# EAGLE board Ideamart-NB-IoT-Air-Quality-Sensor-v1 (EAGLE 8.6.0)
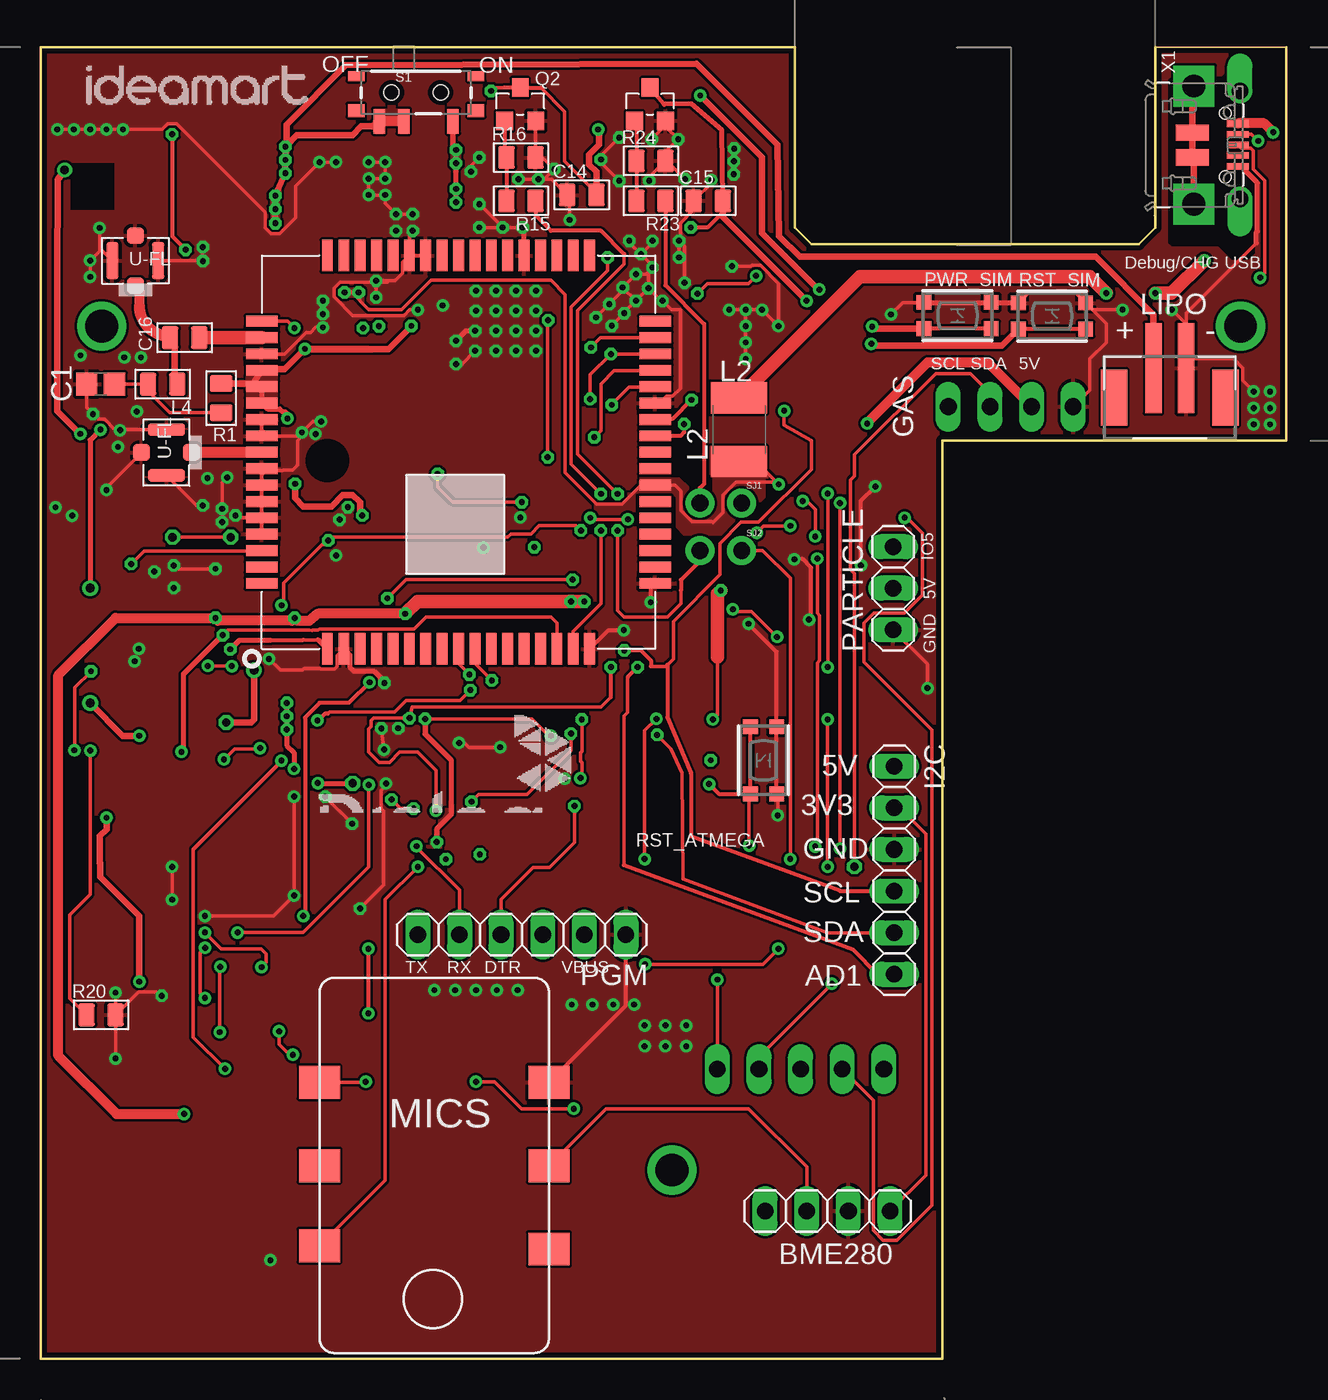
[diagram p3: board, top side]
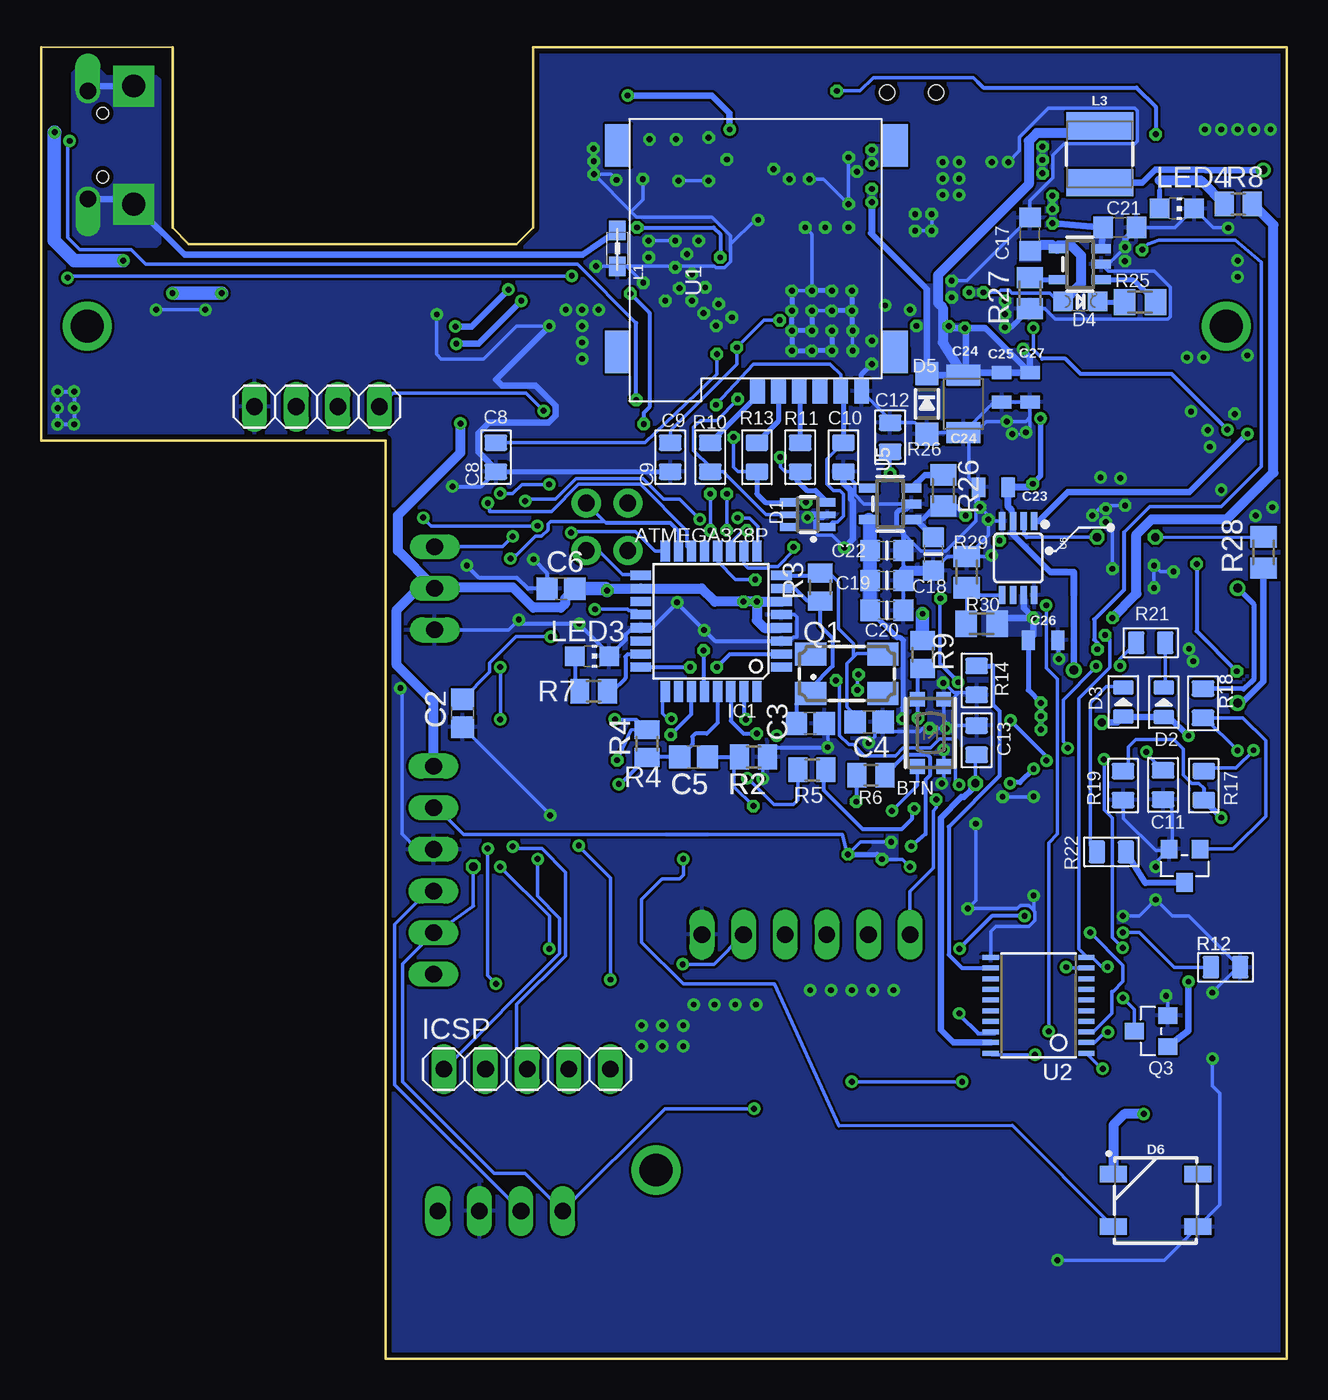
[diagram p4: board, bottom side, seen from below]

Size 76 x 80 mm. Coordinates in mm from the lower left corner, seen from the top.
Outline: 0,0 0,80 46,80 46,69 47,68 67,68 68,69 68,80 76,80 76,56 55,56 55,0 0,0
Copper layers (1*16): Top 0.035mm / dielectric 1.5mm / Bottom 0.035mm
Design rules "default *": minimum track width 8mil, minimum drill 14mil, track to track 6mil, track to pad 6mil, pad to pad 6mil, via to via 6mil, smd to smd 6mil, copper to edge 12mil, drill to drill 8mil, minimum pad ring 10mil, minimum via ring 8mil, stop-mask expansion 4mil, vias tented up to drill 14mil, thermal gap 8mil
Net classes: 1 power: width 0.406 mm, drill 0.356 mm, clearance 0.152 mm; 2 gnd: width 0.203 mm, drill 0.356 mm, clearance 0.152 mm; 3 usbvcc: width 0.203 mm, drill 0.356 mm, clearance 0.152 mm; 4 aref: width 0.203 mm, drill 0.356 mm, clearance 0.152 mm; 5 ant: width 0.33 mm, clearance 0.66 mm

## Footprints (pad centres in the part's own frame; a part is rotated, then mirrored left to right if it is on the bottom)
1X04 = drill 1.016 long: 1 -3.81,0; 2 -1.27,0; 3 1.27,0; 4 3.81,0
BTN_KMR2_4.6X2.8 = smd 0.9 x 0.9: A 2.05,0.8; A' -2.05,0.8; B 2.05,-0.8; B' -2.05,-0.8
C0805 = smd 1.3 x 1.4: 1 -0.85,0; 2 0.85,0
0805 = smd 1.016 x 1.397: 1 -0.889,0; 2 0.889,0
_0805 = smd 1.2 x 1.3: 1 -1.016,0; 2 1.016,0
_0805MP = smd 1.2 x 1.3: 1 -1.016,0; 2 1.016,0
0805' = smd 0.8 x 1.2: 1 -0.9,0; 2 0.9,0
1210 = smd 1.27 x 2.06: 1 -1.755,0; 2 1.755,0
SOT363 = smd 0.5 x 1: 1 -0.75,-1.2; 3 0.75,-1.2; 4 0.75,1.2; 6 -0.75,1.2 | smd 0.4 x 1: 2 0,-1.2; 5 0,1.2
LED-0805 = smd 0.889 x 1.27: + -0.889,0; - 0.889,0
CHIPLED_0805 = smd 1.2 x 1.2: A 0,-1.05; C 0,1.05
SOD-123 = smd 1.4 x 1.4: A 1.85,0; C -1.85,0
WS2812B = smd 1.651 x 1: 1 2.577,-1.6; 2 2.577,1.6; 3 -2.577,1.6; 4 -2.577,-1.6
4P-U-FL = smd 1.016 x 1.016: D -1.524,0; GND3 1.524,0 | smd 2.286 x 0.762: GND1 0,1.397; GND2 0,-1.397
1X06 = drill 1.016 long: 1 -6.35,0; 2 -3.81,0; 3 -1.27,0; 4 1.27,0; 5 3.81,0; 6 6.35,0
TQFP32-08 = smd 1.27 x 0.559: 1 -4.293,2.8; 2 -4.293,2; 3 -4.293,1.2; 4 -4.293,0.4; 5 -4.293,-0.4; 6 -4.293,-1.2; 7 -4.293,-2; 8 -4.293,-2.8; 17 4.293,-2.8; 18 4.293,-2; 19 4.293,-1.2; 20 4.293,-0.4; 21 4.293,0.4; 22 4.293,1.2; 23 4.293,2; 24 4.293,2.8 | smd 0.559 x 1.27: 9 -2.8,-4.293; 10 -2,-4.293; 11 -1.2,-4.293; 12 -0.4,-4.293; 13 0.4,-4.293; 14 1.2,-4.293; 15 2,-4.293; 16 2.8,-4.293; 25 2.8,4.293; 26 2,4.293; 27 1.2,4.293; 28 0.4,4.293; 29 -0.4,4.293; 30 -1.2,4.293; 31 -2,4.293; 32 -2.8,4.293
1X05 = drill 1.016 long: 1 -5.08,0; 2 -2.54,0; 3 0,0; 4 2.54,0; 5 5.08,0
0805'' = smd 1.2 x 1: 1 -1.1,0; 2 1.1,0
L1812 = smd 1.9 x 3.4: 1 -1.95,0; 2 1.95,0
INDUCTOR_4X4MM = smd 4.089 x 1.651: P$1 0,1.727; P$2 0,-1.727
L0805 = smd 1.016 x 1.397: 1 -0.889,0; 2 0.889,0
CHIP-LED0805 = smd 1.2 x 1.2: A 0,-1.05; C 0,1.05
JST-PH-2-SMT = smd 1 x 5.5: 1 -1,-1.8; 2 1,-1.8 | smd 1.6 x 3.4: NC1 -3.4,0; NC2 3.4,0
1X03 = drill 1.016 long: 1 -2.54,0; 2 0,0; 3 2.54,0
CTS406 = smd 1.9 x 1.4: 1 -2.2,-1.2; 2 2.2,-1.2; 3 2.2,1.2; 4 -2.2,1.2
SOT23 = smd 1.016 x 1.143: 1 -0.95,-1.016; 2 0.95,-1.016; 3 0,1.016
R0805 = smd 1.15 x 1.5: 1 -0.85,0; 2 0.85,0
M0805 = smd 1.3 x 1.6: 1 -0.95,0; 2 0.95,0
SWITCH-SPST-SMD-A = smd 0.7 x 1.5: 1 -2.25,-1.75; 2 -0.75,-1.75; 3 2.25,-1.75 | smd 1 x 0.6: GND1 -3.65,1; GND3 3.65,1 | smd 1 x 0.8: GND2 -3.65,-1.1; GND4 3.65,-1.1 | hole 0.9: -1.5,0; 1.5,0
SPARKFUN-PASSIVES_PTH-JUMPER-NC_BOTTOM_NO_SILK = drill 1.016 pad 1.778: 1 -1.27,0; 2 1.27,0
MICROSIM = smd 1.5 x 0.9: 1 -0.8,2.5; 2 -0.8,5.04; 3 -0.8,7.58; 5 -0.8,1.23; 6 -0.8,3.77; 7 -0.8,6.31 | smd 2.61 x 1.56: P$1 1.6,-0.8; P$2 14.2,-0.8; P$3 14.2,16.1; P$4 1.6,16.1
TSSOP20 = smd 0.305 x 0.991: 1 -2.925,-2.918; 2 -2.275,-2.918; 3 -1.625,-2.918; 4 -0.975,-2.918; 5 -0.325,-2.918; 6 0.325,-2.918; 7 0.975,-2.918; 8 1.625,-2.918; 9 2.275,-2.918; 10 2.925,-2.918; 11 2.925,2.918; 12 2.275,2.918; 13 1.625,2.918; 14 0.975,2.918; 15 0.325,2.918; 16 -0.325,2.918; 17 -0.975,2.918; 18 -1.625,2.918; 19 -2.275,2.918; 20 -2.925,2.918
SIM7000 = smd 1.93 x 0.66: 1 -12,8; 2 -12,7; 3 -12,6; 4 -12,5; 5 -12,4; 6 -12,3; 7 -12,2; 8 -12,1; 9 -12,0; 10 -12,-1; 11 -12,-2; 12 -12,-3; 13 -12,-4; 14 -12,-5; 15 -12,-6; 16 -12,-7; 17 -12,-8; 35 12,-8; 36 12,-7; 37 12,-6; 38 12,-5; 39 12,-4; 40 12,-3; 41 12,-2; 42 12,-1; 43 12,0; 44 12,1; 45 12,2; 46 12,3; 47 12,4; 48 12,5; 49 12,6; 50 12,7; 51 12,8 | smd 0.66 x 1.93: 18 -8,-12; 19 -7,-12; 20 -6,-12; 21 -5,-12; 22 -4,-12; 23 -3,-12; 24 -2,-12; 25 -1,-12; 26 0,-12; 27 1,-12; 28 2,-12; 29 3,-12; 30 4,-12; 31 5,-12; 32 6,-12; 33 7,-12; 34 8,-12; 52 8,12; 53 7,12; 54 6,12; 55 5,12; 56 4,12; 57 3,12; 58 2,12; 59 1,12; 60 0,12; 61 -1,12; 62 -2,12; 63 -3,12; 64 -4,12; 65 -5,12; 66 -6,12; 67 -7,12; 68 -8,12
SOT23-5 = smd 0.55 x 1.2: 1 -0.95,-1.3; 2 0,-1.3; 3 0.95,-1.3; 4 0.95,1.3; 5 -0.95,1.3
MSOP8 = smd 0.4 x 1.1: 1 -0.975,-2.25; 2 -0.325,-2.25; 3 0.325,-2.25; 4 0.975,-2.25; 5 0.975,2.25; 6 0.325,2.25; 7 -0.325,2.25; 8 -0.975,2.25
MICS-VZ-89TE = smd 2.5 x 2: 1 -7,5.95; 2 -7,0.87; 3 -7,-4.21; 4 7,-4.21; 5 7,0.87; 6 7,5.75
4UCONN_20329_V2 = smd 1 x 2: BASE@1 -0.75,-2; BASE@2 0.75,-2 | smd 0.4 x 1.35: D+ 0,0.775; D- -0.65,0.775; GND 1.3,0.775; ID 0.65,0.775; VBUS -1.3,0.775 | drill 1.016 pad 1.454 offset: SPRT@1 -3.3,0.9; SPRT@2 3.3,0.9 | drill 1.397 pad 2.5 square: SPRT@3 -3.6,-1.9; SPRT@4 3.6,-1.9 | hole 0.7: -1.95,0; 1.95,0

## Placement (x,y rotation side)
BME280  [1X04]  48,9 0 top
BTN  [BTN_KMR2_4.6X2.8]  21.74,38.18 270 bottom
C1  22pF  [C0805]  3.64,59.45 0 top
C2  100n  [C0805]  50.29,39.37 90 bottom
C3  22pF  [C0805]  29.08,38.76 180 bottom
C4  22pF  [C0805]  25.49,38.84 180 bottom
C5  100n  [C0805]  36.2,36.71 180 bottom
C6  100n  [C0805]  44.29,46.97 0 bottom
C8  22pF  [0805]  48.26,54.99 90 bottom
C9  22pF  [0805]  37.62,54.99 90 bottom
C10  100n  [0805]  27.05,54.99 270 bottom
C11  100n  [0805]  7.55,35 90 bottom
C12  22pF  [0805]  24.21,56.21 270 bottom
C13  100n  [0805]  18.93,37.72 270 bottom
C14  100n  [0805]  33,71 0 top
C15  100n  [0805]  40.72,70.64 0 top
C16  33pF  [0805]  8.77,62.29 0 top
C17  10uF  [_0805]  15.67,68.61 90 bottom
C18  10uF  [_0805MP]  21.57,49.1 270 bottom
C19  10uF  [_0805MP]  24.41,47.48 0 bottom
C20  1uF  [_0805MP]  24.41,45.65 0 bottom
C21  10uF  [_0805]  10.19,69.02 0 bottom
C22  100n  [_0805MP]  24.41,49.31 0 bottom
C23  22uF  [0805']  17.91,53.17 180 bottom
C24  100uF  [1210]  19.74,58.25 270 bottom
C25  33pF  [0805']  17.4,59.26 270 bottom
C26  22uF  [0805']  14.86,43.83 0 bottom
C27  10pF  [0805']  15.67,59.25 270 bottom
D1  [SOT363]  29.24,51.49 90 bottom
D2  GREEN  [LED-0805]  7.51,40.05 90 bottom
D3  RED  [LED-0805]  9.97,40.07 90 bottom
D4  ORANGE  [CHIPLED_0805]  12.6,64.5 270 bottom
D5  MMSZ5231BT1G  [SOD-123]  21.97,58.25 270 bottom
D6  WS2812B  [WS2812B]  8,9.65 0 bottom
GAS  [1X04]  59.18,58.08 0 bottom
GPS  U-FL  [4P-U-FL]  5.76,66.99 90 top
I2C  [1X06]  52.07,29.79 270 top
IC1  ATMEGA328P-20MU  [TQFP32-08]  35.13,44.99 180 bottom
ICSP  [1X05]  46.35,17.65 0 bottom
L1  BLM21  [0805'']  40.85,67.73 90 bottom
L2  500mA  [L1812]  42.6,56.67 90 top
L3  2.2UH3A  [INDUCTOR_4X4MM]  11.42,73.48 0 bottom
L4  33nH  [L0805]  7.43,59.46 180 top
LED3  YELLOW  [CHIP-LED0805]  42.4,42.85 270 bottom
LED4  GREEN  [CHIP-LED0805]  6.71,70.17 270 bottom
LIPO  [JST-PH-2-SMT]  68.88,58.64 180 top
PARTICLE  [1X03]  52,47 90 top
PGM  [1X06]  29.34,25.87 180 top
PWR_SIM  [BTN_KMR2_4.6X2.8]  55.93,63.64 0 top
Q1  16MHz  [CTS406]  26.85,41.79 0 bottom
Q2  9013  [SOT23]  29.24,76.53 0 top
Q3  9013  [SOT23]  8.29,19.98 90 bottom
Q4  9013  [SOT23]  6.24,30.07 180 bottom
Q5  9013  [SOT23]  37.16,76.53 0 top
R1  22R  [0805]  11,58.6 270 top
R2  1k  [R0805]  32.54,36.71 180 bottom
R3  1M  [R0805]  28.48,47.07 90 bottom
R4  10k  [R0805]  39.04,37.52 90 bottom
R5  1k  [R0805]  28.98,35.92 0 bottom
R6  1k  [R0805]  25.38,35.59 0 bottom
R7  1k  [R0805]  42.3,40.72 0 bottom
R8  1k  [R0805]  2.96,70.44 0 bottom
R9  10k  [R0805]  22.23,42.96 90 bottom
R10  22R  [0805]  35.18,54.99 270 bottom
R11  22R  [0805]  29.7,54.99 270 bottom
R12  47k  [0805]  3.74,23.88 0 bottom
R13  22R  [0805]  32.34,54.99 90 bottom
R14  47k  [0805]  18.93,41.38 270 bottom
R15  4.7k  [0805]  29.29,70.64 180 top
R16  47k  [0805]  29.29,73.28 0 top
R17  4.7k  [0805]  5.07,34.96 270 bottom
R18  4.7k  [0805]  5.11,39.98 270 bottom
R19  47k  [0805]  9.99,34.96 270 bottom
R20  47k  [0805]  3.67,20.97 0 top
R21  300R  [0805]  8.31,43.67 180 bottom
R22  300R  [0805]  10.7,30.91 0 bottom
R23  4.7k  [0805]  37.21,70.64 180 top
R24  47k  [0805]  37.21,73.08 0 top
R25  1k  [M0805]  8.96,64.47 0 bottom
R26  100k  [M0805]  20.96,52.96 270 bottom
R27  2.2k  [M0805]  15.67,65.01 270 bottom
R28  750k  [M0805]  1.42,49.19 90 bottom
R29  100k  [M0805]  19.54,47.98 90 bottom
R30  750k  [M0805]  18.62,44.83 180 bottom
RF  U-FL  [4P-U-FL]  7.66,55.29 180 top
RST_ATMEGA  [BTN_KMR2_4.6X2.8]  44.09,36.5 90 top
RST_SIM  [BTN_KMR2_4.6X2.8]  61.7,63.61 0 top
S1  [SWITCH-SPST-SMD-A]  22.89,77.25 0 top
SJ1  SPARKFUN-PASSIVES_JUMPER-PTH-2-NC  [SPARKFUN-PASSIVES_PTH-JUMPER-NC_BOTTOM_NO_SILK]  41.48,52.2 180 top
SJ2  SPARKFUN-PASSIVES_JUMPER-PTH-2-NC  [SPARKFUN-PASSIVES_PTH-JUMPER-NC_BOTTOM_NO_SILK]  41.48,49.31 180 top
U1  MICROSIM  [MICROSIM]  24.72,59.82 90 bottom
U2  [TSSOP20]  15.15,21.55 90 bottom
U3  SIM7000  [SIM7000]  25.48,55.3 90 top
U4  MCP73831T-2ACI/OT  [SOT23-5]  12.63,66.78 90 bottom
U5  AP2112-3.3  [SOT23-5]  24.21,52.15 90 bottom
U6  PAM2401  [MSOP8]  16.39,48.85 180 bottom
U$1  MICS-VZ-89TE  [MICS-VZ-89TE]  24,12.63 180 top
X1  [4UCONN_20329_V2]  72.26,74.05 270 top

## Tracks (layer width: path | path; a pad name or v marks a point on that pad's centre or on a via)
+3V3  (via drill 0.36)
  Top 0.203: U$1.6 21,10.88 21,28 v23,30 | BME280.4 54,11.19 54,32 52.4,33.6 I2C.2 | v23.43,39.03 29.97,39.03 31,38 v31.12,38
  Top 0.305: v24.14,31.51 24.14,32.33 25.04,33.23 25.04,36.49 23.43,38.1 v23.43,39.03
  Bottom 0.203: 52.13,33.87 50.24,31.97 27.11,31.97 26.86,30.84 v26.78,30.76 26.03,31.51 v24.14,31.51 | v23,30 23.46,30.46 v24.7,30.46
  Bottom 0.305: v23.43,39.03 23.43,39.73 23.4,39.76 23.4,43.81 23.57,43.99 23.77,43.99 C20.1 | I2C.2 52.07,33.8 52.13,33.87 | v26.78,30.76 25,30.76 v24.7,30.46
  Bottom 0.813: C20.1 C19.1 C22.1 25.43,51.12 U5.5
  pour Bottom (rank 2, no thermals): 24.41,51.74 24.41,45.24 24.82,44.83 26.24,44.83 26.24,51.74 26.04,51.95 24.62,51.95
  pour Bottom (rank 2, no thermals): 24.62,45.24 23.8,45.24 22.99,44.43 22.99,38.33 23.19,38.13 23.8,38.13 23.8,43.82 24.01,44.02 24.21,44.02 25.02,44.83
  pour Bottom (rank 2, no thermals): 23.8,32.64 25.22,32.64 25.22,31.22 25.63,30.81 34.78,30.81 35.38,31.42 35.38,33.05 35.79,33.46 37.62,33.46 37.82,33.25 37.82,30.2 37.42,29.8 24.41,29.8 23.8,30.41
  pour Top (rank 3): 22.99,38.74 22.99,33.86 23.6,33.25 23.6,31.22 25.22,31.22 25.22,33.66 23.8,35.08 23.8,38.94 23.19,38.94
+4.1V  (via drill 0.36)
  Top 0.203: v14.91,73.94 14.98,74.02 | 20.56,75.5 S1.1
  Top 0.406: 20.56,75.5 20.25,75.18 19.54,75.18 19,74.64 15.61,74.64 14.98,74.02 | 14.98,74.02 14.98,75.3 18.59,78.9 40,79 44.95,74.05 45.05,68.49 46.31,67.23 64.36,67.23 67.88,63.71 LIPO.2 | 14.98,74.02 v14.91,73.13 v14.91,72.32 v14.3,70.95 v14.3,70.13 v14.3,69.27
  Top 0.61: S1.2 20.56,75.5
  Bottom 0.406: v14.3,69.27 C21.1 U4.3
  pour Top (rank 2, no thermals): 14.05,68.81 14.05,71.25 17.4,71.25 20.3,73.94 20.3,76.43 22.94,76.43 22.96,72.19 22.79,72.01 19.48,68.81
  pour Bottom (rank 2, no thermals): 14.66,69.02 14.66,70.44 15.67,71.45 15.67,73.89 15.06,74.5 11.2,74.5 10.19,73.49 10.19,67.59 10.39,67.39 11.61,67.39 12.83,68.61 14.25,68.61
+5V  (via drill 0.36, 0.5)
  Top 0.203: 41.28,42.8 41.28,39.28 v41,39
  Top 0.305: v15,40 15,37.42 15.45,36.98 15.45,36.97 v15.45,35.98 | v16.89,35.11 v16.9,35.1 v19.01,35.1
  Top 0.61: v22.23,45.45 16.9,45.45 16.37,45.01 15.65,45.01 v15.47,45.19 15.31,45.03 10.81,45.03 v10.64,45.19 4.55,45.19 1.06,41.7 1.06,18.48 4.62,14.92 v8.73,14.92 | GAS.2 57.73,60.8 54.12,60.8 50.42,57.1 v50.42,57.05
  Top 0.813: v22.23,45.45 22.97,46.19 v32.34,46.19 v33.15,46.19 | 41.28,42.8 41.28,46.66 v41.48,46.87
  Bottom 0.203: v40.87,36.5 40.01,38.35 R4.2 39.67,39 v41,39 | v19.01,35.1 19.01,36.75 C13.2
  Bottom 0.305: C26.1 15.78,40.78 v15,40 v15,39.19 v15,38.37 | v15.45,35.98 16.28,35.15 16.85,35.15 v16.89,35.11
  Bottom 0.406: U2.19 20.35,19.28 21.12,20.04 21.12,31.75 21.12,32.64 21.12,33 19.85,34.26 19.7,34.26 19.26,34.7 19.26,34.85 v19.01,35.1 | C26.1 15.47,44.12 v15.47,45.19 | U6.7 16.06,45.78 v15.47,45.19 | v15.47,45.19 17.32,45.19
  Bottom 0.61: v10.64,45.19 9.17,46.66 9.17,50.29 8.24,51.21 3.66,51.21 0.82,54.05 0.82,69.18 2.09,70.44 R8.2 | v32.34,46.19 IC1.6 | IC1.4 31.89,44.59 32.34,45.04 v32.34,46.19 | PARTICLE.2 52,47.05 | 52,47.05 54.24,49.29 54.24,51.46 50.42,55.28 v50.42,57.05 | I2C.1 52.07,40.07 54.31,42.31 54.31,45.69 52.95,47.05 52,47.05 | 52,47.05 47.23,47.05 45.98,45.81 44.3,45.81 44.04,46.08 44.04,46.38 C6.2 42.95,46.99 IC1.18 35.71,46.99 34.91,46.19 v32.34,46.19 | v8.73,14.92 9.9,14.92 10.58,14.25 D6.3 | 17.32,45.19 R30.1
  Bottom 0.813: v22.23,45.45 R9.2 | C6.2 41.58,46.97 v41.48,46.87
  pour Bottom (rank 2, no thermals): 14.76,44.17 14.76,45.85 16.69,45.85 17.2,45.34 17.2,44.17
  pour Bottom (rank 2, no thermals): 15.52,44.17 18.52,44.17 18.52,46.54 15.52,46.54
AD1  (via drill 0.36)
  Top 0.203: 35.79,41.58 35.79,39.43 35.56,39.2 35.56,30.09
  Top 0.254: v36.4,42.19 36.1,41.9 35.79,41.58 | 35.56,30.09 49.56,24.93 51.05,23.44 I2C.6
  Bottom 0.254: v36.4,42.19 IC1.24
AD2  (via drill 0.36)
  Top 0.203: v37.55,39.03 36.83,38.31 v36.83,30.48
  Bottom 0.203: IC1.25 38.1,40.53 38.1,39.37 37.76,39.03 v37.55,39.03 | D6.4 16.76,14.23 27.32,14.21 31.27,22.86 36.83,22.86 39.37,25.4 39.37,28.02 38.13,29.26 37.05,29.26 36.81,29.5 36.81,30.46 v36.83,30.48
AREF  (via drill 0.36)
  Top 0.203: v44.92,44.03 43.35,45.59 42.34,45.59 v42.22,45.72
  Bottom 0.203: C2.2 48.63,41.88 48.63,42.45 47.02,44.07 44.96,44.07 v44.92,44.03 | v42.22,45.72 40.23,45.72 40.16,45.65 39.69,45.65 IC1.20
ATMEGA_RXD  (via drill 0.36)
  Top 0.203: v21.14,46.38 22.28,47.53 v32.44,47.53
  Top 0.254: v20.04,41.26 18.78,40 17,40 16.11,39.11 16.11,27.11 v16,27 | v19.97,25 v19.97,21.06 v19.98,21.06
  Bottom 0.203: v32.44,47.53 33.66,47.53 34.73,48.65 IC1.12 | 21.16,42.4 21.16,46.36 v21.14,46.38 | 17.83,19.83 17.84,19.84 17.98,19.84 U2.18
  Bottom 0.254: 21.16,42.4 20.32,41.55 20.24,41.55 20.04,41.35 v20.04,41.26 | v16,27 18,27 20,25 v19.97,25 | v19.98,21.06 19.98,20.98 18.83,19.83 17.83,19.83
ATMEGA_TXD  (via drill 0.36)
  Top 0.203: v32.95,50.52 32.64,50.83 30.41,50.83 29.9,50.32 28.68,50.32 28.48,50.12 21.59,50.12 17.73,50.12 v17.53,49.91 17.27,49.66 17.15,49.66 14.82,47.32 14.82,46.1 v14.68,45.96 | v14.53,19.96 14.53,19.18 15.17,18.54 v15.37,18.54
  Bottom 0.203: v32.95,50.52 33.2,50.52 33.81,49.91 33.81,49.4 IC1.11 | v14.53,19.96 14.53,31.47 14,32 14,41.46 14.68,42.14 v14.68,45.96 | v15.37,18.54 17.98,18.54 U2.20
BTN_1  (via drill 0.36)
  Top 0.203: v24.1,33.41 24.1,35.88 22.98,37 21.9,37 21.26,36.37 20.64,36.37 20,37 20,38.43 20.13,38.56 20.13,38.93 20.3,39.1 22.47,39.1 v22.49,39.08 22.63,39.76 34.17,39.76 34.77,40.37
  Top 0.254: 34.77,40.37 v34.77,42.19
  Bottom 0.203: v24.1,33.41 22.54,34.97 BTN.B
  Bottom 0.254: R9.1 22.54,41.79 BTN.B' 22.55,39.36 v22.49,39.08 | IC1.2 33.98,42.99 v34.77,42.19
DTR  (via drill 0.36)
  Top 0.203: v32.56,33.71 32.56,31.5 31.03,29.97 30.03,29.97 28.07,28.02 PGM.4
  Bottom 0.203: 33.35,36.67 33.73,36.29 33.73,34.88 v32.56,33.71
  Bottom 0.254: C5.1 R2.2 33.35,36.67
EN  (via drill 0.5)
  Top 0.203: v8.03,50.11 v11.58,50.11
  Bottom 0.203: R28.2 7.98,50.09 v8.03,50.11 | v11.58,50.11 15.88,50.12
  Bottom 0.254: U6.2 16.06,50.3 15.88,50.12
GND  (via drill 0.36, 0.36 pad 0.55)
  Top 0.203: v4.55,18.31 4.55,20.96 R20.2 | v8,28 v8,30 | R20.2 4.56,22.21 4.55,22.23 v4.55,22.33 | U3.29 37.62,58.16 38.17,58.72 38.55,58.72 39.01,59.18 39.01,64.01 38.46,64.01 v37.92,64.55 37.82,64.55 v37.06,65.31 | v10.64,48.19 8.31,48.19 v8.11,48.39 | v9.88,52.05 9.49,52.05 RF.GND1 | v54.09,40.91 54.09,42.37 PARTICLE.1 | 69.88,63.12 69.88,63.78 74.17,68.07 | v37.31,66.58 36.91,66.17 v36.3,66.17 v35.49,65.36 | v26.5,61.5 25.68,60.69 v25.33,60.69 | U3.64 U3.65 | v17.09,57.18 16.59,57.18 v15.92,56.51 15.92,56.27 | C1.1 2.79,58.02 v3.18,57.64 3.51,57.31 3.89,57.31 4.51,56.68 7.53,56.68 | RST_SIM.A' 60.23,65 63.16,65 RST_SIM.A | v11.05,51.03 v11.05,51.84 11.05,53.45 v11.36,53.76 | U3.64 12,51.3 v11.87,51.44 | v40.91,71.92 41,72 41,71.81 C15.1 39.83,70.09 39.02,69.28 39.02,68.28 v38.94,68.2 | v26.24,72.42 26.24,72.78 v26.75,73.28 | v26.75,70.44 28.09,69.09 | 28.09,69.09 v28.17,69.02 v29.39,69.02 | v26.75,69.02 28.02,69.02 28.09,69.09 | v9.87,67.82 v9.88,67.81 v9.88,66.97 9.86,66.99 GPS.GND2 | U3.46 U3.45 | U3.46 22.48,68.61 v22.68,68.81 | U3.46 22.06,66.88 22.06,66.23 21.6,65.77 v20.45,65.77 | v20.45,65.77 v20.45,64.75 | v22.68,69.83 v21.67,69.83 21,70.5 v21,71 v20,71 v20,72 v21,72 v21,73 v20,73 | v36.6,67.39 37.31,68.1 v37.31,68.2 | v36.6,67.39 35.89,68.1 v35.89,68.2 | v36.6,67.39 37.31,66.68 v37.31,66.58 | v35.49,65.36 v36.3,64.55 | v36.3,64.55 35.59,63.83 v35.59,63.78 v34.83,63.02 | v33.86,63.53 v34.67,64.34 35.49,65.16 v35.49,65.36 | v36.3,64.55 v37.06,65.31 | v37.06,65.31 37.06,66.32 v37.31,66.58 | v38.94,67.19 v38.94,68.2 | v38.94,68.2 39.27,67.87 v39.27,65.64 | v37.11,71.86 37.11,72.09 R24.2 38.18,73.08
  Top 0.203: v35.28,71.86 34.17,72.97 v34.17,73.17 34.17,73.39 v35.28,74.5 | v29.14,71.96 v30.36,71.96 | v30.36,71.96 30.71,71.96 v31.32,72.57 30.61,73.28 R16.2 30.18,75.51 Q2.2 | v30.36,71.96 31.15,71.96 C14.1 32.26,70.85 v32.26,69.47 | v18.98,32.64 17.34,34.27 v17.34,34.28 | v15.45,34.29 v15.45,28.25 14.2,27 v10,27 | v19.47,27.46 20.91,28.91 20.91,33.4 20.75,33.56 20.75,34.67 21.05,34.97 v21.05,35.09 | v37.27,74.4 38.11,75.25 | 38.11,75.25 Q5.2 | 38.11,75.25 38.11,75.18 v38.89,74.4 38.18,73.69 38.18,73.08 | v39.3,71.96 38.18,73.08 | GAS.1 64,59.09 64,61 65,62 65,63.16 RST_SIM.A | RST_SIM.A 64.16,64 v66,64 | v69,64 69.88,63.12 | 69.88,63.12 69.88,61 | 69.88,61 LIPO.1 | v42.16,66.65 43.33,66.65 43.37,66.7 43.9,66.7 45,65.6 v45,63 v44,64 v43,64 | v51.86,63.72 52.59,64.44 PWR_SIM.A' | U3.2 18.06,42.88 18.06,42.23 17.91,42.08 17.04,42.08 17.03,42.09 16.06,42.09 15.97,42 14.62,42 13.93,42.69 v13.91,42.69 | U3.64 U3.63 U3.62 13.48,54.2 14.75,54.2 14.76,54.21 15.36,54.21 15.65,54.5 15.65,56 15.92,56.27 | R20.2 5.95,22.36 7.03,22.36 7.26,22.13 v7.37,22.13 | v28.02,37.3 26.13,37.3 25.86,37.57 v25.51,37.57 | U3.58 13.48,56.39 | 13.48,56.39 | v20.93,37.16 v20.77,38.44 | GPS.GND1 3.58,67.77 v3.58,68.98 3.58,67.58 v3,67 v3,66 | v74,59 73.34,59.66 73.34,60.44 72.78,61 69.88,61 | v43,64 v43,63 | v43,63 v43,61 | v43,62 v43,63 | v18,73 v17,73 15.55,71.55 15.55,69.62 14.57,68.64 14.04,68.64 13.67,69.01 13.67,69.94 8.27,75.34 7.74,75.34 7.4,75 v5,75 v4,75 v3,75 v2,75 v1,75 | v42,64 v43,64 | v20.45,65.77 21.23,65.77 21.16,65.69 18.26,65.69 17.88,65.32 17.88,64.79 19.03,63.64 22.15,63.64 22.5,64 v23,64 | RF.GND3 4,53.15 v4,53
  Top 0.203: U3.59 15.92,56.27 | v44.96,33.15 44.96,34.39 RST_ATMEGA.B' | v17.2,62.92 16.76,62.92 16.45,62.61 16.19,62.61 14.88,61.3 U3.54
  Top 0.254: RST_ATMEGA.B' RST_ATMEGA.B 44.89,43.12 v43.18,44.83 | U3.17 34.63,44.45 v35.56,44.45 | v37.21,46.15 37.21,47.03 U3.18 | v50.04,48.39 50.04,52.34 v50.91,53.21 | v46.86,45.09 46.99,45.21 46.99,48.26 46.48,48.77 v45.97,48.77 | U$1.3 35.69,21.54 PGM.1
  Top 0.305: v25.33,62.11 25.94,62.72 v26.5,62.72 | PWR_SIM.A' PWR_SIM.A 59.62,64.44 RST_SIM.A' | U3.2 18.84,42.94 18.84,42.21 19.11,41.95 20.33,41.95 20.73,41.54 20.73,41.46 v20.96,41.23 | v42.29,73.05 42.28,73.04 v42.28,72.26 | U3.39 29.48,68.93 v29.39,69.02 | 74.17,68.07 74.17,68.73 74.22,68.78 74.22,71.74 73.55,72.41 73.55,72.77 73.53,72.75 X1.GND
  Top 0.406: RF.GND2 7.53,56.68
  Top 0.61: U3.61 13.48,54.2 | U3.59 13.48,56.39
  Bottom 0.203: IC1.5 30.05,45.39 29.9,45.24 29.9,44.02 30.1,44.02 30.3,43.82 30.81,43.82 IC1.3 | v14,6 7.47,6 D6.1 4.1,9.38 4.1,16.19 4.55,16.64 v4.55,18.31 | Q4.2 7,31.27 7,33.16 7.01,33.17 7.01,33.57 C11.1 | Q4.2 7.27,31 8,31 9.97,32.97 9.98,32.97 R19.2 | v8,30 8,30.27 Q4.2 | v4.55,22.33 3,23.88 R12.2 5.98,27 7,27 v8,28 9,27 v10,27 | C24.2 21.88,56.49 D5.A 22.68,57.1 C12.1 24.21,57.28 U1.5 | C24.2 19.39,56.14 | C24.2 17.87,58.36 C25.2 C27.2 15.67,57.43 | C23.2 18.81,52.03 v18.72,51.95 18.21,51.44 v18.21,51.19 | U6.4 18.21,51.1 v18.21,51.19 | v18.21,51.19 18.21,50.26 R29.2 | R29.2 20.72,48.94 C18.2 | v10.64,48.19 10.64,50.63 v11.05,51.03 | v11.87,51.44 11.46,51.84 v11.05,51.84 10.84,52.05 v9.88,52.05 | v6.91,48.02 7.73,48.02 v8.11,48.39 v8.11,47.02 | I2C.3 53.06,31.06 54,32 54,40.81 v54.09,40.91 | v39.27,65.64 40.26,66.63 L1.1 40.87,66.65 v42.16,66.65 34.94,66.65 34.84,66.55 34.31,66.55 33.94,66.92 33.94,68 | 15.67,57.43 15.92,57.18 18.35,57.18 19.39,56.14 | C20.2 C19.2 C22.2 | v21.67,69.83 v21.67,68.81 v22.68,68.81 | v28.98,63.94 28,63.94 v27.77,63.94 | v17.2,64.55 v17.2,63.73 v17.2,62.92 | v40.91,71.92 41.25,72.26 v42.28,72.26 40.01,69.99 | v26.5,62.72 v26.5,61.5 | v37.31,68.2 v38.94,68.2 | 33.94,68 33.94,68.51 35.08,69.65 39.67,69.65 40.01,69.99 | v39.3,71.96 39.3,70.7 40.01,69.99 | v29.14,71.96 28.27,71.96 v26.75,70.44 v26.75,73.28 | 33.94,68 32.46,69.47 v32.26,69.47 | v31.97,35.37 31.97,36.42 R2.1 | v9.87,67.82 10.91,66.78 U4.2 10.9,66.36 8.09,66.36 7.1,65.37 7.1,63.56 7.25,63.41 14.12,63.41 14.77,64.06 R27.2 | v20.77,38.44 20.77,38.8 20.94,38.97 BTN.A' 20.4,40.23 20,40.62 | v20.77,38.44 21.77,38.44 v21.79,38.46 22.21,38.46 22.39,38.27 24.07,38.27 C4.1 24.64,38.51 25.13,38.35 25.13,37.95 v25.51,37.57
  Bottom 0.203: v20.77,38.44 20.6,38.61 C13.1 | R14.2 19.06,40.62 20,40.62 | v20.96,41.23 20.91,41.23 20.31,40.62 20,40.62 | v20.45,65.77 19.54,65.77 C17.2 15.68,70.66 14.28,72.06 14.28,73.42 13.57,74.13 9.27,74.13 9.12,74.28 9.12,76.14 9.27,76.29 14.54,76.29 16.31,74.52 16.31,73.69 v17,73 | v29.39,69.02 28.98,68.61 v28.98,65.16 v30.2,65.16 | v17.34,34.28 15.57,34.28 15.5,34.35 v15.45,34.3 v15.45,34.29 | U2.11 18.07,26.06 17.77,26.36 15.74,26.36 15.37,26.74 15.37,27.26 15.45,27.35 | 15.45,27.35 15.74,27.64 16.26,27.64 16.43,27.46 v19.47,27.46 18.98,27.95 v18.98,32.64 | v15.45,28.25 15.45,27.35 | v21.05,35.09 20.94,35.2 BTN.A 20.94,37.15 v20.93,37.16 | v35.28,71.86 v37.11,71.86 | C21.2 7.02,69.02 7,69 6.83,69 LED4.C 4.49,69 3.6,69 v3.58,68.98 | v66,64 v69,64 | v45,63 47,63 49.02,60.98 51.59,60.98 51.9,61.28 51.9,63.47 51.86,63.5 v51.86,63.72 | R29.2 18.07,48.94 v18,49 | v7.37,22.13 7.27,22.04 Q3.2 | C3.1 28.02,38.55 v28.02,37.3 | C23.2 18.96,53.01 18.96,51.11 20.81,49.26 22.32,49.26 23.76,50.7 23.76,51.58 23.61,51.73 23.33,51.73 U5.2 25.79,52.15 26.36,52.72 26.36,53.41 C10.2 | C23.2 19.39,53.74 19.39,56.14 | 15.67,57.43 15.68,57.43 15.68,56.76 v15.92,56.51 16.02,56.41 v16.76,56.41 | v27,49.48 27.75,50.24 28.64,50.24 28.79,50.38 28.79,51.09 28.64,51.24 28.28,51.24 D1.2 | PARTICLE.1 47.49,44.46 v46.86,45.09 | C2.1 44.96,33.19 v44.96,33.15
  Bottom 0.254: 37.21,46.1 v37.21,46.15 | 37.21,46.1 v35.56,44.45 34.9,43.79 IC1.3 | R2.1 31.1,37.3 v28.02,37.3 | v50.04,48.39 49.29,47.64 46.98,47.64 46.31,46.97 C6.1 45.14,47.94 v45.97,48.77 | v50.91,53.21 49.16,53.21 C8.1 | v46.86,45.09 46.61,44.83 v43.18,44.83 41.35,43 LED3.C 40.34,43.86 40.34,44.18 39.93,44.59 IC1.21 38.73,44.59 37.21,46.1 | v13.91,42.69 13.91,43.78 C26.2 | v74,59 v74,58 v74,57 v75,57 v75,58 v75,59 v74,59
  Bottom 0.305: R27.2 16.81,62.92 v17.2,62.92 | U5.2 23.28,51.78 23.64,51.78 23.81,51.6 23.81,50.8 23.4,50.38 C22.2 | v42.31,73.83 42.31,73.07 v42.29,73.05 | v30.2,65.16 v30.2,63.94 v30.2,62.72 | v27.77,65.16 v28.98,65.16 | v26.55,65.16 v26.55,63.94 | v26.55,63.94 26.55,62.77 v26.5,62.72 | v26.55,63.94 28,63.94 | v28.98,63.94 v28.98,62.72 v30.2,62.72 | v27.77,62.72 v27.77,61.5 v28.98,61.5 v30.2,61.5 v30.2,62.72 | C8.1 C9.1 | U1.5 25.95,60.06 v25.33,60.69
  Bottom 0.406: C10.2 27.05,53.41 26.6,52.95 26.6,52.45 26.47,52.33 26.47,50.01 v27,49.48 | v29.25,51.32 29.08,51.49 D1.2 | v45,63 48.26,59.74 47.89,59.37 45.84,59.37 44.61,58.14 44.61,57.53 45.04,57.1 48.68,57.1 49.32,56.47 49.32,55.3 48.26,54.25 C8.1 | v9.87,67.82 9.86,67.82 9.86,68.33 C21.2
  Bottom 0.61: C18.2 23.32,48.09 23.35,48.11 23.4,48.06 C19.2
  other vias: 36.83,20.32 38.1,20.32 39.37,20.32 39.37,19.05 38.1,19.05 36.83,19.05 5.71,42.55 5.97,43.31 24.51,64.26 24,22.48 25.27,22.48 26.54,22.48 27.81,22.48 29.08,22.48 32.38,21.59 33.66,21.59 34.92,21.59 36.2,21.59 10.16,53.72 5.84,57.78 4.83,56.64 4.7,55.63 0.89,51.94 1.91,51.44 6.1,61.09 5.08,61.09 2.41,61.21
  pour Bottom: -3.39,-1 85.65,-1 85.65,81.58 -3.39,81.58
  pour Top: -4,-1.81 82.73,-1.81 82.73,81 -4,81
  pour Top: 4.32,68.07 4.32,66.17 4.45,66.04 7.24,66.04 7.24,68.2 7.11,68.33 4.57,68.33
  cutout Top: 6.1,56.64 9.02,56.64 9.02,53.85 6.22,53.85 6.22,56.64 6.99,56.64 6.48,57.15 6.35,57.15 6.1,56.9
GNSS_ANT
  Top 0.813: U3.53 C16.2
IO0  (via drill 0.36)
  Top 0.203: v26.27,33.98 26.71,34.42 29.65,34.42 32.34,37.11 v32.34,38.13
  Bottom 0.254: IC1.30 33.93,38.91 33.15,38.13 v32.34,38.13 | R6.1 26.27,35.55 v26.27,33.98
IO1  (via drill 0.36)
  Top 0.203: v32.92,35.42 33,35.5 33,36.37 32.92,36.44 32.92,36.97 33,37.05 v33,39 v33.01,39
  Bottom 0.203: R5.1 29.83,34.08 30.1,33.8 31.3,33.8 v32.92,35.42
  Bottom 0.254: IC1.31 33.13,39.23 32.95,39.05 v33.01,39
IO5  (via drill 0.36)
  Top 0.203: v35.82,51.21 33.6,51.21 v33.52,51.3 | v47.24,50.16 47.24,51.82 46.74,52.32 v46.48,52.32
  Bottom 0.203: v33.52,51.3 32.8,51.3 32.27,50.76 32.27,49.34 IC1.9 | v35.82,51.21 37.06,52.45 38.05,52.45 39.3,53.7 43.37,53.7 44.62,52.45 46.35,52.45 v46.48,52.32 | PARTICLE.3 47.87,49.54 v47.24,50.16
IO6  (via drill 0.36)
  Bottom 0.203: v30.1,49.51 30.1,49.3 31.07,48.34 31.63,48.34 31.73,48.24 32.9,48.24 33.13,48.47 IC1.10
M8RXD  (via drill 0.36)
  Top 0.203: PGM.5 25.53,28.58 22.91,31.2 v22.91,31.26
  Bottom 0.254: v22.91,31.26 22.05,32 22.05,35.31 21.79,35.56 21.79,36.7 21.95,36.86 23.26,36.86 R6.2
M8TXD  (via drill 0.36)
  Top 0.203: v22.73,33.56 21.94,33.56 v21.39,34.11
  Bottom 0.203: PGM.6 22.99,28.52 21.58,29.93 21.58,33.42 21.39,33.61 v21.39,34.11
  Bottom 0.254: R5.2 28.27,35.77 28.27,34.69 25.88,32.3 23.5,32.3 22.89,32.91 22.89,33.4 v22.73,33.56
MISO  (via drill 0.36)
  Top 0.203: ICSP.2 50.79,15.75 50.79,7.82 51.39,7.22 52.23,7.22 54.36,9.35 54.36,37.72 | 54.36,37.72 | 54.36,37.72 54.36,38.35 50.22,42.49 50.22,44.88 50.82,45.48 52.67,45.48 53.78,46.58 53.78,50.36 52.83,51.31 v52.7,51.31 | v43.67,50.39 44.08,50.8 v45.72,50.8 v45.73,50.81
  Bottom 0.203: IC1.16 37.93,49.53 38.11,49.71 38.11,49.46 IC1.16 | IC1.16 38.57,49.28 39.74,50.45 43.62,50.45 v43.67,50.39 | v45.73,50.81 52.21,50.81 v52.7,51.31
MOSI  (via drill 0.36)
  Top 0.203: v47.24,31.24 47.37,31.37 47.37,38.73 47.37,38.74 47.37,42.45 47.5,42.59 47.5,45.35 47.37,45.48 v47.37,48.81
  Bottom 0.203: 41.53,50.98 41.63,51.08 | 41.63,51.08 SJ1.1 | v47.37,48.81 47.16,49.02 46.99,49.02 45.84,50.17 45.47,50.17 45.09,50.55 45.09,50.92 44.93,51.08 41.63,51.08 | ICSP.3 46.99,18.29 46.99,21.59 44.01,24.58 44.01,29.67 45.46,31.11 47.12,31.11 v47.24,31.24
  Bottom 0.254: 41.53,50.98 37.62,50.98 37.13,50.49 IC1.15
N$1
  Bottom 0.254: LED3.A 43.45,41.02 R7.1
N$2
  Bottom 0.406: R26.1 22.1,53.91 U5.3
N$3
  Bottom 0.203: 7.75,71.89 7.75,71.26
  Bottom 0.305: LED4.A 7.75,71.26
  Bottom 0.61: 7.75,71.89 5.26,71.89 R8.1
N$4
  Bottom 0.305: D4.C 11.69,64.5 11.75,64.47 R25.1
N$5
  Bottom 0.305: U4.1 9.37,65.83 R25.2
N$6  (via drill 0.36)
  Top 0.203: v10.01,22 9.71,22.29 9.71,23.8 9.72,23.81 9.72,24.77 v10.02,25.06 | v11.16,36.56 11.81,37.2 13.38,37.2 13.38,37.23 v13.37,37.25 | v11.64,42.25 10.23,42.25 10.22,42.24 10.2,42.24 v10.18,42.26
  Bottom 0.203: v10.01,22 9.3,21.29 Q3.3 | v10.02,25.06 10.65,25.7 10.65,32.99 11.14,33.48 11.14,36.54 v11.16,36.56 | v13.37,37.25 13.37,37.37 13.64,37.64 13.64,40.18 11.67,42.15 11.61,42.15 11.64,42.19 v11.64,42.25 | v10.18,42.26 10.18,42.69 R21.2
N$7
  Bottom 0.203: R21.1 7.42,41.03 D2.-
N$8  (via drill 0.36)
  Top 0.406: v6,23 6,27 3.61,29.39 3.61,30.24 3.6,30.25 3.6,31.89 4,32.3 v4,33
  Bottom 0.203: 5.04,34.77 5.36,35.09 5.8,35.09 6.33,35.61 6.33,37.19 6.91,37.77 9.22,37.77 9.68,37.31 9.68,36.16 R19.1
  Bottom 0.254: R17.2 5.04,34.77
  Bottom 0.406: Q3.1 6,20 v6,23 | v4,33 R17.2
N$9
  Bottom 0.305: U4.5 15.55,65.83 R27.1
N$10
  Bottom 0.305: U1.7 31.03,57.19 R13.2
N$11
  Bottom 0.254: U6.5 19.1,46.6 R29.1 19.54,44.67 R30.2
N$12
  Bottom 0.305: U1.3 32.3,58.77 R10.1
N$13
  Bottom 0.254: U1.2 29.7,58.96
  Bottom 0.305: 29.7,58.96 R11.1
N$14
  Top 0.254: Q5.1 36.33,75.41 R24.1 R23.2
N$15  (via drill 0.36)
  Top 0.406: 73.06,75.37 X1.VBUS
  Top 0.508: 73.05,75.33 X1.VBUS arc-90 73.05,75.33
  Top 0.61: v75.19,74.82 74.64,75.37 73.06,75.37
  Top 0.813: L2.2 49.98,66 64,66 v65,65 | v68,65 68.97,65 70.97,67 v71,67
  Bottom 0.813: v65,65 v68,65 | v71,67 74,67 75.21,68.21 75.21,74.82 v75.19,74.82
N$16
  Bottom 0.406: Q4.3 8.64,29.03 R22.2
N$17
  Bottom 0.203: R22.1 12,31.32 12,40 11,41 10.02,41 D3.-
N$18  (via drill 0.36)
  Top 0.203: v3.01,37.09 3.01,28.32 1.76,27.08 1.76,21.99 R20.1
  Bottom 0.203: Q4.1 3.29,31.09 1.29,33.09 1.29,37.7 2.68,39.09 R18.2 5.01,39.09 v3.01,37.09
N$19
  Top 0.33: GPS.D 5.76,65.39 6.01,65.14
  Top 0.406: C16.1 8.16,62.01 8.16,59.61 L4.1
  Top 0.61: 6.01,64.23 6.01,65.14
  Top 0.66: C16.1 7.88,62.37 arc-90 6.01,64.23
N$20  (via drill 0.36)
  Top 0.203: v10,26 11,25 13.44,25 13.74,24.69 13.74,24.16 v13.46,23.88
  Bottom 0.203: v10,26 9,26 6.88,23.88 R12.1 | U2.9 13.41,23.83 v13.46,23.88
N$21
  Bottom 0.254: 17.93,42.27 17.93,39.9 17.53,39.51 17.53,35.55 20.63,32.44 20.63,24.63 19.83,23.83 U2.12
  Bottom 0.305: R14.1 17.93,42.27
N$22  (via drill 0.36, 0.5)
  Top 0.406: v2.4,56.42 1,57.82 1,66 1.03,71.92 v1.44,72.53
  Bottom 0.406: U6.1 15.13,51.1 13.36,52.86 5.96,52.86 2.5,56.33 | 2.5,56.33 | 2.5,56.33 v2.4,56.42 | v1.44,72.53 4.96,72.53 4.99,72.56 8.03,72.56 8.83,71.75 L3.P$2
N$23
  Bottom 0.254: IC1.23 40.2,42.99 40.36,42.83 40.36,41.51 41.14,40.73 R7.2
N$25  (via drill 2 pad 0.3)
  other vias: 73.2,63
N$26  (via drill 2)
  other vias: 38.5,11.5
N$27
  cutout Top: 1.83,72.95 4.47,72.95 4.47,70.1 1.83,70.1
N$28
  cutout Top: 68.79,78.02 68.79,68.06 68.99,67.86 71.84,67.86 72.65,67.05 73.66,67.05 74.07,67.45 74.07,78.43 73.66,78.83 72.65,78.83 72.04,78.22 68.99,78.22
N$29
  Top 0.203: C1.2 L4.2 6.53,59.44 6.53,59.04 7.85,57.71 R1.2
N$30  (via drill 2 pad 0.3)
  other vias: 3.7,63
N$36
  Top 0.254: Q2.1 28.29,73.39 R16.1 R15.2
NETLIGHT  (via drill 0.36, 0.55)
  Top 0.203: U3.52 15.04,63.3 v15.47,62.87
  Top 0.305: v3.63,56.67 3,56.05 v3,47
  Bottom 0.203: 14.92,61 15.47,61.55 v15.47,62.87 | v15.47,62.87
  Bottom 0.254: v3.63,56.67 7.03,60.07 12.57,60.07 13.5,61 14.92,61
  Bottom 0.305: R18.1 2.64,40.84 2.23,41.23 2,41.47 2,46 v3,47
PWRKEY  (via drill 0.36)
  Top 0.203: 28.27,77.55 27.66,77.55 v27.46,77.35 | 30.51,77.55 30.51,77.53 31.96,76.09 31.96,73.04 33.89,71.11 C14.2
  Top 0.254: 30.51,77.55 Q2.3 28.27,77.55 | PWR_SIM.B PWR_SIM.B' | v8,74.7 v8.01,74.7 8.01,68.48 v8.83,67.66 | 16.91,43.87 16,43.86 14,43.83
  Top 0.305: v11.55,43.27 12.11,43.83 14,43.83 | 16.91,43.87 U3.1
  Top 0.406: PWR_SIM.B' 50.72,62.84 v50.72,62.97 | v40.23,77.07 44,73.3 44,68.68 47.45,65.22 v47.5,65.22 | v34,75 34.04,74.96 34.04,74.08 33.43,73.47 33.43,72.86 33.89,72.4 C14.2
  Bottom 0.203: v27.46,77.35 26.04,77.35 25.23,78.16 19.13,78.16 18.82,77.86 | 9.93,50.42 8.35,52 4,52 1.57,54.43 1.55,54.43 1.55,66.9 3.15,68.25 7.8,68.25 8.48,68.01 v8.83,67.66
  Bottom 0.254: 18.82,77.86 18.52,77.55 9.17,77.55 8,76.38 v8,74.7 | 9.93,50.42 9.93,46.92 11.75,45.1 11.75,43.87 11.55,43.67 v11.55,43.27
  Bottom 0.406: v50.72,62.97 49.76,62.97 v47.5,65.22 | v40.23,77.07 35.07,77.07 34,76 v34,75
RESET  (via drill 0.36, 0.36 pad 0.55)
  Top 0.203: ICSP.5 v41.27,23.11 | RST_ATMEGA.A' 43.2,34.37 v43.2,31.3
  Top 0.254: RST_ATMEGA.A RST_ATMEGA.A' 41.37,34.45 v40.77,35.05
  Bottom 0.203: v41.27,23.11 41.27,29.34 43.18,31.24 43.18,31.28 v43.2,31.3
  Bottom 0.254: IC1.29 34.73,38.78 35.38,38.13 36.09,38.13 36.28,37.94 36.28,37.48 C5.2 39.01,36.71 R4.1 40.66,35.05 v40.77,35.05
RF_ANT
  Top 0.66: U3.60 13.47,55.29 RF.D
SCK  (via drill 0.36)
  Top 0.203: v45.72,30.48 45.72,47.62 44.04,49.3 SJ2.1
  Bottom 0.203: IC1.17 39.47,47.83 40.54,47.83 42.02,49.3 SJ2.1 | v45.72,30.48 45.72,28.22 44.37,26.87 44.37,24.72 ICSP.1
SCL  (via drill 0.36)
  Top 0.203: 37.21,42.23 38.14,42.23 38.23,42.32 38.58,42.67 38.58,44.98 41.43,47.83 41.43,49.73 42.72,51.03 43.79,51.03 47,54.24 47,56 45.35,56.95 v45.35,57.84 | U$1.2 34.48,15.24 43.18,15.24 46.73,11.69 BME280.2
  Top 0.254: 37.21,42.23 37.21,42.6 36.6,43.21 v35.59,43.21 | 38.23,42.32 38.23,39.12 39.65,35.72 39.66,31.9 48.77,28.56 48.78,28.52 I2C.4
  Bottom 0.203: BME280.2 54.43,16.7 54.43,26.49 52.4,28.52 I2C.4 | v45.35,57.84 46.42,58.91 54.54,58.91 GAS.4
  Bottom 0.254: v35.59,43.21 35.59,40.75 IC1.28
SDA  (via drill 0.36, 0.5)
  Top 0.203: v37.59,38.05 38.45,37.2 39.12,35.71 39.16,29.27 48.02,25.98 I2C.5 | GAS.3 58.03,58.2 58.03,58.78 56.71,60.1 54.6,60.1 49.64,55.15 49.64,53.86 49.39,53.6 49.39,48.14 49.64,47.88 v49.64,30.01 | U$1.4 19.77,16.84 v19.81,16.89 | v26.54,16.89 27.69,16.89 29.34,15.24 v32.51,15.24
  Bottom 0.203: v32.51,15.24 37.95,15.24 BME280.1 46.48,11.29 48.38,11.29 53.97,16.87 53.97,24.08 I2C.5 51.99,25.91 49.63,27.61 49.64,27.61 v49.64,30.01 | v19.81,16.89 v26.54,16.89
  Bottom 0.254: IC1.27 36.33,39.32 v37.59,38.05
SHIELD
  Top 0.406: X1.SPRT@4 70.36,73.2 X1.BASE@2 X1.BASE@1 70.26,77.55 X1.SPRT@3
  Bottom 0.406: X1.SPRT@2 70.66,70.75 X1.SPRT@4 67.27,67.36 42.98,67.36 L1.2 | X1.SPRT@3 72.86,77.65 X1.SPRT@1
  pour Bottom (rank 2, no thermals): 68.99,78.22 68.79,78.02 68.79,68.06 68.99,67.86 71.84,67.86 72.65,67.05 73.66,67.05 74.07,67.45 74.07,78.43 73.66,78.83 72.65,78.83 72.04,78.22
SIM7000_PWRKEY_MCU  (via drill 0.36)
  Top 0.203: 35.59,67.39 35.59,66.78 32.74,63.94 32.74,55.2 v35.18,52.76 | 39.04,46.87 39.04,46.05 38.23,45.24 35.59,45.24 35.18,45.65 v35.18,50.52
  Top 0.254: 35.59,67.39 34.17,68.81 31.12,68.81 30.18,69.75 R15.1 | 39.04,46.87 39.04,47.5 40.21,48.67 SJ2.2
  Bottom 0.203: v35.18,52.76 v35.18,50.52
SIM7000_RESET  (via drill 0.36)
  Top 0.203: v34.57,67.19 34.57,66.37 32.34,64.14 32.34,54.59 v34.17,52.76 | v34.17,50.52 34.17,46.05 32.48,44.37 U3.16
  Top 0.254: 38.03,76.53 Q5.3 | RST_SIM.B RST_SIM.B' | v39.65,69.02 40.67,69.02 41.61,69.96 C15.2
  Top 0.305: C15.2 41.55,74.95 39.67,76.56 38.03,76.53
  Top 0.406: RST_SIM.B' 58.63,61.8 50.85,61.8 50.72,61.92 v50.67,61.92 | v46.71,64.54 41.61,69.64 C15.2
  Bottom 0.203: v34.17,52.76 v34.17,50.52
  Bottom 0.254: v34.57,67.19 34.57,68.61 34.98,69.02 v39.65,69.02
  Bottom 0.406: v46.71,64.54 49.33,61.92 v50.67,61.92
SIM7000_RESET_MCU
  Top 0.254: R23.1 38.1,65.48 40.47,63.12 40.47,53.37 40.21,53.12 SJ1.2
SIM7000_RXD  (via drill 0.36, 0.36 pad 0.55)
  Top 0.203: U3.10 26.48,42.41 v27.51,41.38 | v12,26 16,26 20,30 v20,35
  Bottom 0.203: U2.3 11.8,19.93 10.67,21.06 10.67,22.4 10.6,22.4 10,23 10,24 v12,26 | v27.51,41.38 27.3,41.17 27.3,38.03 26.73,37.46 26.46,37.46 25.77,36.77 23.89,36.77 23.42,37.24 21.75,37.24 21.2,37.79 20.43,37.79 20.24,37.59 20.24,35.24 v20,35
SIM7000_TXD  (via drill 0.36, 0.36 pad 0.71)
  Top 0.203: v26.2,40.79 25.58,40.16 22.29,40.16 21.59,39.46 17.61,39.46 17.5,39.35 | U3.9 25.48,42.4 v26.14,41.74 | 9.3,31.07 9.3,19.61 v11.23,17.68
  Top 0.254: 17.5,39.35 17.35,39.35 16.93,38.93 v16.87,38.93 | v14.67,36.49 14.67,36.44 9.3,31.07
  Bottom 0.203: v26.14,41.74 26.2,41.67 v26.2,40.79 | v11.23,17.68 11.32,17.71 U2.1
  Bottom 0.254: v16.87,38.93 14.67,36.73 v14.67,36.49
SIM_CLK  (via drill 0.36)
  Top 0.203: U3.32 v34.77,61.29 33.51,60.02 v33.51,58.55
  Bottom 0.203: C8.2 39.17,55.88 34.77,60.08 v34.77,61.29 | v33.51,58.55 34.77,57.23 35.79,57.23 36.2,56.82 36.2,55.4 35.18,54.38 R10.2 35.16,54.13 34.42,54.13 31.78,51.49 D1.5
SIM_DATA  (via drill 0.36)
  Top 0.203: U3.31 37.46,60.28 34.98,60.28 34.17,59.47 34.17,56.62 v33.76,56.21 | v29.34,52.25 25.12,52.25 24.21,53.17 v24.21,53.98
  Bottom 0.203: R13.1 33.48,54.11 33.76,54.38 v33.76,56.21 | D1.4 29.35,52.24 v29.34,52.25 | C12.2 v24.21,53.98
  Bottom 0.305: D1.4 31.82,52.24 32.34,52.76 R13.1
SIM_RST  (via drill 0.36)
  Top 0.203: U3.33 34.16,62.3 v33.56,61.7 | v30.91,54.99 30.91,63.32 v30.94,63.35
  Bottom 0.203: C9.2 37.62,56.62 33.56,60.69 v33.56,61.7 31.9,63.35 v30.94,63.35 | R11.2 30.64,54.11 30.91,54.38 v30.91,54.99
  Bottom 0.305: R11.2 29.9,53.57 29.29,52.96 28.76,52.96 D1.3
SIM_USB_DM_M  (via drill 0.36)
  Top 0.203: v74.27,74.29 73.86,74.7 X1.D-
  Top 0.254: U3.28 37.51,57.33 38.53,57.33 v39.7,58.5
  Bottom 0.203: 39.7,63.18 43.29,66.77 69.62,66.77 70.51,67.66 70.73,67.66 71.12,67.66 73.66,67.66 74.4,68.4 74.4,74.16 v74.27,74.29
  Bottom 0.254: v39.7,58.5 39.7,63.18
SIM_USB_DP_P  (via drill 0.36)
  Top 0.203: v74.39,65.94 74.67,66.22 74.67,71.87 73.96,72.58 73.96,73.7 73.81,73.85 73.23,73.85 X1.D+ | v40.06,64.98 40.67,65.6 43.17,65.6 v43.64,66.06
  Top 0.254: U3.27 39.03,56.3 39.25,56.52 v39.25,57.03
  Bottom 0.203: v74.39,65.94 74.39,66.04 43.66,66.04 v43.64,66.06
  Bottom 0.254: v40.06,64.98 38.89,63.81 38.89,58.04 39.25,57.69 v39.25,57.03
SIM_VDD  (via drill 0.36)
  Top 0.203: U3.30 37.44,59.26 35.89,59.26 v34.83,58.2
  Bottom 0.203: U1.1 27.22,60.03 27.87,60.69 32.54,60.69 v34.83,58.2 | C10.1 28.07,54.87 28.07,53.37 27.66,52.96 27.26,52.96 27.05,52.76 27.05,51.41 27.43,51.04 27.74,51.04 D1.1
  Bottom 0.305: C10.1 27.05,58.86 U1.1
SS  (via drill 0.36)
  Top 0.203: v48.75,52.2 48.75,31.13 v48.77,31.11 | v48.26,22.86 43.81,18.41 ICSP.4
  Bottom 0.203: IC1.14 36.6,49.55 36.6,50.5 39.44,53.34 43.22,53.34 44.88,51.69 48.64,51.69 48.64,52.09 v48.75,52.2 | v48.77,31.11 48.77,23.37 v48.26,22.86
STATUS  (via drill 0.36)
  Top 0.203: v5.5,48.49 6.29,49.28 13.46,49.28 U3.66 | v2.03,37.12 2.05,37.13 2.05,40.93 v3.05,41.93
  Bottom 0.203: v2.03,37.12 3.12,36.03 5.08,36.03 R17.1
  Bottom 0.254: v5.5,48.49 5.5,44.38 v3.05,41.93
V+  (via drill 0.36, 0.36 pad 0.55, 0.5, 0.55)
  Top 0.305: S1.3 25.14,73.93 v25.33,73.74 v25.33,72.93 v25.33,71.37 v25.33,70.55 | 12.95,59.49 13.15,59.3 U3.56 U3.57 13.84,57.94 14.57,57.94 14.73,57.77 14.91,57.77 15.04,57.64 v15.04,57.36
  Top 0.406: R1.1 12.95,59.49 U3.55 13.54,60.36 14.88,60.36 16.1,61.58 v16.1,61.6 21.2,61.6 v22.6,63.01 | v3,40 5,38 v6,38 | v13,42 13,38.98 12.83,38.81 v11.29,38.81 | v19.6,51.44 19.46,51.58 19.46,52.25 19.03,52.68 18.42,52.68 17.73,52 16,52 15.5,52.5 v15.5,53.37
  Bottom 0.203: 16.8,51.8 16.78,51.83 16.71,51.77 U6.3
  Bottom 0.254: U5.1 22.24,51.2
  Bottom 0.305: v19.6,51.44 20.18,52.01 R26.2 | 21.43,52.01 22.24,51.2 | v15.5,53.37 15.04,53.83 v15.04,57.36 | v6,38 6.02,37.98
  Bottom 0.406: U6.3 16.72,51.09 16.72,50.28 14.44,48 13,48 v13,42 | R28.1 1.42,41.33 2.75,40 v3,40 | 6.02,37.98 7.2,39.16 D2.+ 9.95,39.16 D3.+ 10.34,38.81 v11.29,38.81 | 16.8,51.8 17.01,52 C23.1 15.71,53.17 v15.5,53.37 | C27.1 C25.1 19.58,60.16 | 19.58,60.16 C24.1 21.88,60 D5.C 21.97,65.27 25.39,68.68 25.33,68.74 v25.33,70.55 | v19.65,62.88 19.58,62.8 19.58,60.16 | C27.1 18.4,62.88 v19.65,62.88 | C27.1 15.67,61.08 15.93,61.33 15.93,61.42 v16.1,61.6 | C18.1 22.65,51.2 U5.1 | R26.2 21.43,52.01 | v19.65,62.88 20.51,62.88 v20.62,62.99
  Bottom 0.61: L3.P$1 11.85,74.78 15.26,74.78 15.75,74.29 15.75,71.65 21.29,66.11 21.29,64.4 21,64.11 21,62 C24.1
  pour Bottom (rank 2, no thermals): 14.85,46.66 11.61,46.66 11.61,47.83 11.76,47.98 13.34,47.98 13.74,48.39 13.74,49.41 13.95,49.61 16.23,49.61 16.59,49.97 16.59,50.42 17.25,50.42 17.25,49.05 16.49,48.29 16.47,48.29
  pour Bottom (rank 2, no thermals): 13.24,57.23 13.24,52.76 13.85,52.15 16.44,52.15 16.59,52 16.59,51.69 16.94,51.69 17.3,52.15 17.71,52.15 17.91,52.35 17.91,57.23
  pour Bottom (rank 2, no thermals): 23.6,50.73 22.58,50.73 22.38,50.52 22.38,49.66 22.13,49.41 20.86,49.41 20.65,49.61 20.65,50.42 19.94,51.13 19.94,52.66 20.14,52.86 21.47,52.86 21.77,52.56 21.77,51.74 22.08,51.44 23.6,51.44
  pour Bottom (rank 2, no thermals): 24.01,75.92 24.01,68.61 22.99,67.59 22.18,67.59 21.16,66.58 21.16,63.12 21.14,63.11 15.27,63.11 14.86,62.7 14.86,59.67 15.27,59.26 18.32,59.26 19.33,58.25 22.38,58.25 22.79,58.65 22.79,61.7 23.6,62.72 24.62,62.72 25.83,63.94 25.83,75.92
  pour Top (rank 2, no thermals): 24.82,72.47 25.83,72.47 25.83,76.13 24.82,76.13
  pour Top (rank 2, no thermals): 12.22,58.04 12.22,60.13 14.75,60.13 16.27,61.65 16.27,62.11 16.49,62.11 16.69,61.9 16.69,59.47 15.27,58.04
  pour Bottom (rank 2, no thermals): 13.05,54.16 13.05,62.9 16.69,62.9 16.69,59.47 16.49,59.26 15.06,59.26 14.76,58.96 14.76,53.93 13.29,53.93
  pour Top (rank 2, no thermals): 16.47,62.11 16.47,58.04 18.32,58.04 19.54,57.03 19.94,56.62 19.94,51.13 20.5,50.52 21.57,50.52 21.77,50.73 21.77,59.87 19.54,62.11
VBUS  (via drill 0.36)
  Top 0.203: 18.95,65.05 20,64 22,64 23.79,65.79 31.11,65.79 31.98,64.92 31.98,54.05 33.9,52.12 35.45,52.12 36.62,53.3 U3.24 38.7,53.3 39.07,52.93 39.07,51.73 39.74,51.06 40.94,51.06 41,51 41.61,51.61 41.61,52.67 42.41,53.48 44.88,53.48 v45.02,53.34 43.63,54.72 43,54.72 | 18.95,65.05 v18.52,65.05 | v36.86,24.05 44.05,24.05 v45,25 | v48,30 47.98,30.02 47.98,38.98 v48,39 | v48,42.19 v48.01,42.2 v48.01,52.78 v48,52.78 | 18.95,65.05 v19.38,65.05
  Top 0.406: L2.1 42.32,55 42.72,55 43,54.72
  Bottom 0.203: v36.86,24.05 34.96,24.05 PGM.2 | v45,25 45,27 v48,30 | v45.02,53.34 46.68,53.34 47.23,52.78 v48,52.78 | v48,39 47.98,39.02 47.98,42.17 v48,42.19 | D4.A 13.95,64.5 14.46,65.01 16.77,65.01 16.93,65.18 17.46,65.18 17.59,65.05 v18.52,65.05
  Bottom 0.61: D4.A 12.56,65.59 12.56,67.32 13.16,67.93 13.93,67.93 U4.4 14.1,67.73 14.32,67.95 14.97,67.95 C17.1
  pour Top (rank 2, no thermals): 36.4,52.76 36.4,53.67 38.94,53.67 39.45,53.17 39.45,51.54 39.86,51.13 40.67,51.13 41.07,51.54 41.07,55.6 44.12,55.6 44.12,52.56 41.89,50.32 39.25,50.32 38.84,50.73 38.84,52.56 38.64,52.76
  pour Bottom (rank 2, no thermals): 15.06,66.98 15.06,68.41 17.1,68.41 19.74,65.76 19.74,64.55 18.11,64.55 18.11,65.56 16.69,66.98
  pour Top (rank 2, no thermals): 37.82,52.96 36.4,52.96 36.2,52.76 36.2,51.59 35.84,51.24 31.02,51.24 16.69,65.56 19.74,65.56 19.74,64.34 32.03,52.05 35.49,52.05 35.89,52.45 35.89,53.47 36.1,53.67 37.72,53.67 37.82,53.57
  pour Top (rank 2, no thermals): 45.06,32.08 45.81,32.86 45.56,54.59 44.53,54.59 44.53,53.98 44.33,53.78 41.07,53.78 40.87,53.98 40.87,55.6 43.92,55.6 44.53,56.21 46.78,56.21 46.78,32.08
VDD_EXT  (via drill 0.36)
  Top 0.203: U3.15 31.48,44.88 31.12,45.24 23.5,45.24 22.78,44.52 16.99,44.52 16.91,44.45 16.57,44.45 16.55,44.43 16.38,44.45 11.4,44.45 v11.09,44.14 | v10.91,19.91 10.91,23.87 v10.94,23.9
  Top 0.305: v8.57,37.02 8.69,37.14 8.69,41.74 v11.09,44.14
  Bottom 0.203: U2.2 11.72,19.28 11,20 v10.91,19.91 | v11.09,44.14 10.81,43.86 10.81,42.18 12.7,40.29 12.7,25 12.23,24.53 U2.10 11.88,24.48 11.3,23.9 v10.94,23.9 | v8.57,37.02 8.57,36.91 C11.2
XTAL1
  Bottom 0.254: C3.2 29.93,39.91 Q1.1 29.05,40.91 27.71,42.24 27.71,43.97 28.48,44.73 R3.1 28.51,46.26 29.29,46.26 30.02,46.99 IC1.7
XTAL2
  Bottom 0.203: 28.44,47.88 27.87,47.88 27.36,47.38 27.36,44.53 26.44,43.62 26.44,42.8 | 26.34,39.24 26.85,39.76 26.85,42.4 26.44,42.8 | 26.44,42.8 26.24,43.01 24.67,43.01
  Bottom 0.254: 28.44,47.88 R3.2 28.61,47.79 IC1.8 | 26.34,39.24 C4.2 | 24.67,43.01 Q1.3

## Text on the board
tPlace: OFF | ON | Debug/CHG USB
bPlace: ATMEGA328P
tNames: SCL | SCL | SDA | 5V | IO5 | 5V | GND | 5V | 3V3 | GND | SCL | SDA | TX | RX | DTR | VBUS | AD1 | MICS